# EAGLE design LogicLevelConverter (EAGLE 5.11)
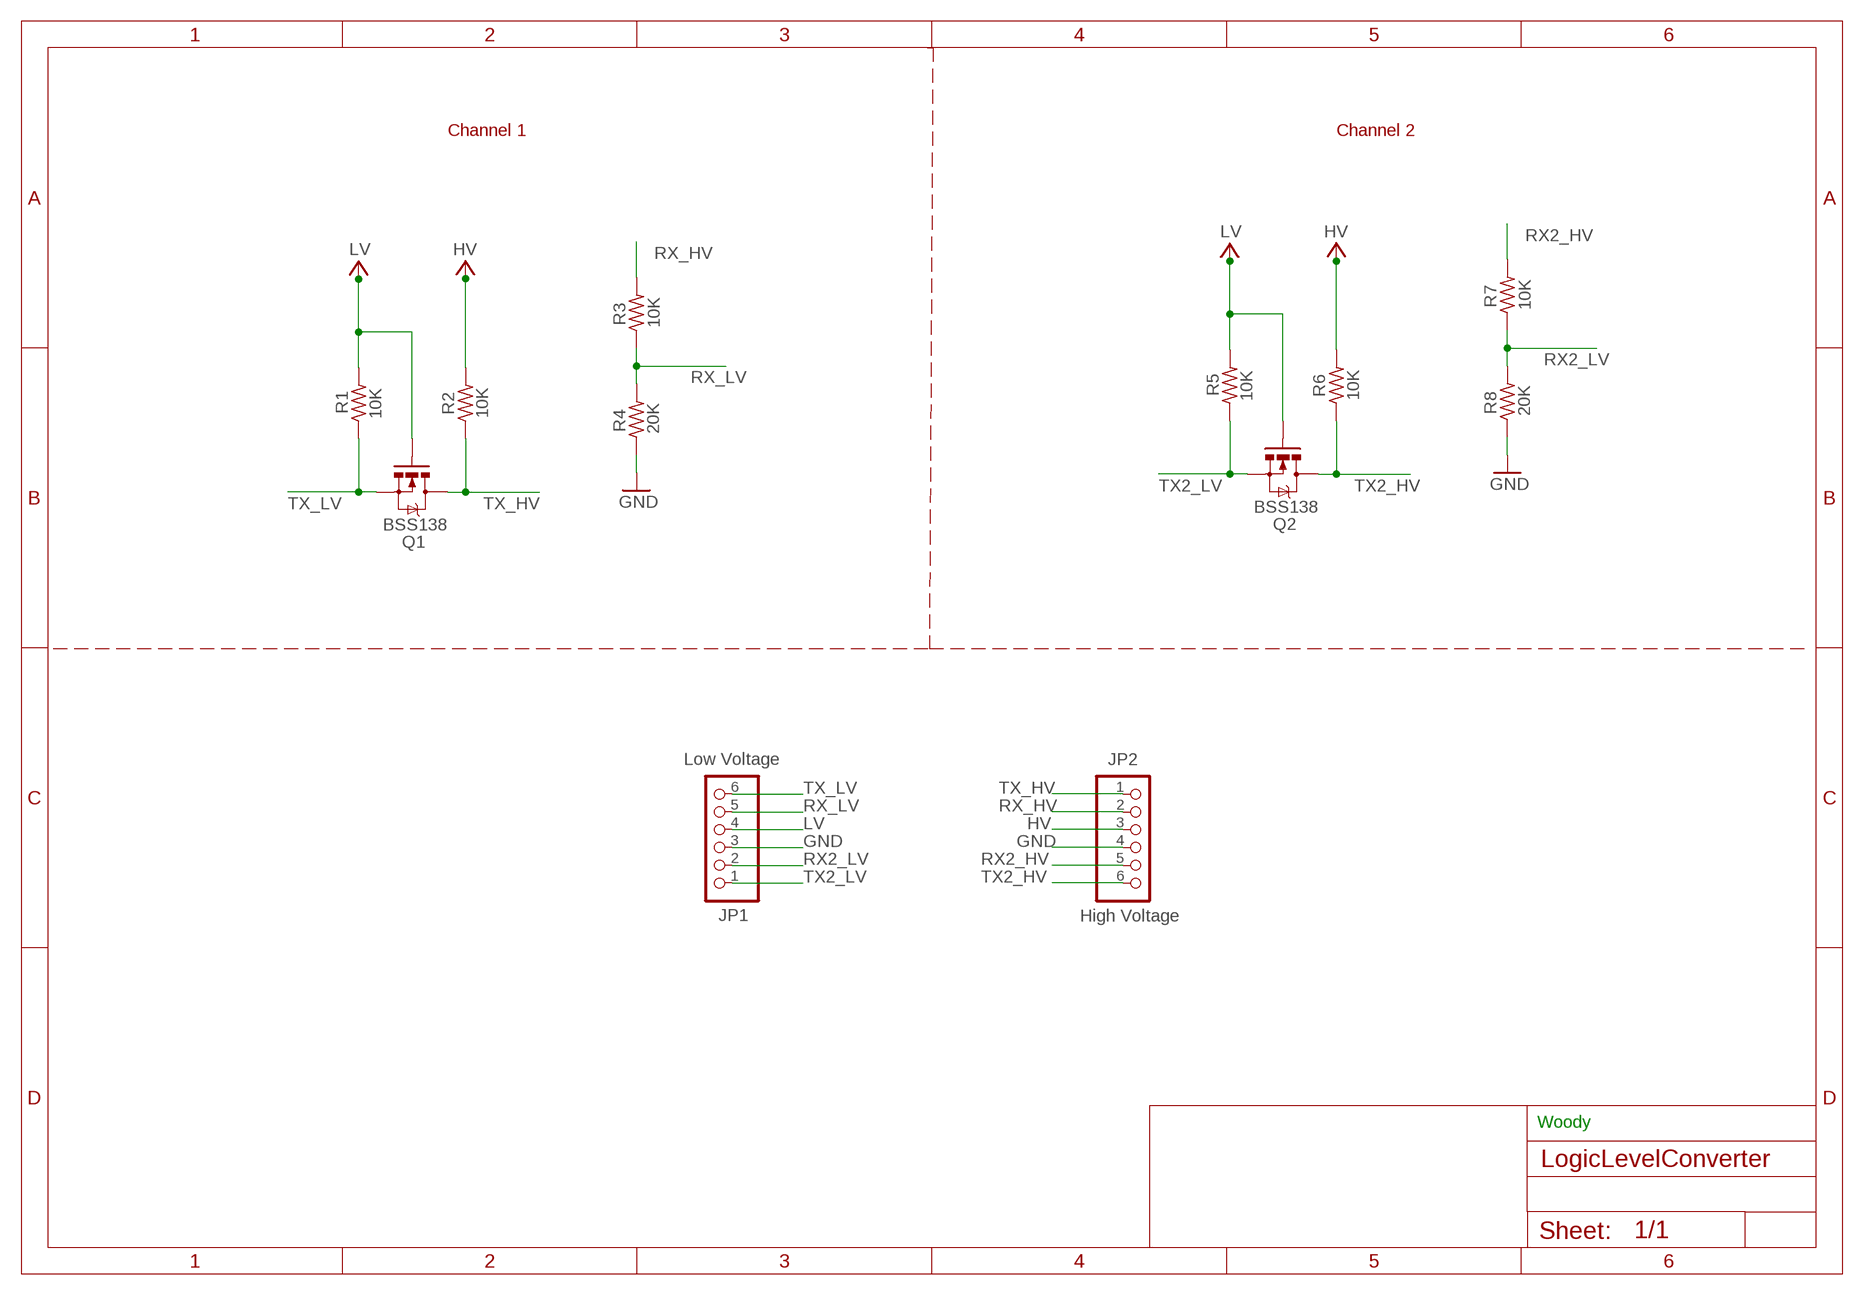
[diagram p0: schematic, sheet 1]

## Parts
JP1  Low Voltage  PINHD-1X06_2.54-S  [1X06-S]
JP2  High Voltage  PINHD-1X06_2.54-S  [1X06-S]
Q1  BSS138  MOSFET-NCHANNELSMD  [SOT23-3]
Q2  BSS138  MOSFET-NCHANNELSMD  [SOT23-3]
R1  10K  R-US_R0805  [R0805]
R2  10K  R-US_R0805  [R0805]
R3  10K  R-US_R0805  [R0805]
R4  20K  R-US_R0805  [R0805]
R5  10K  R-US_R0805  [R0805]
R6  10K  R-US_R0805  [R0805]
R7  10K  R-US_R0805  [R0805]
R8  20K  R-US_R0805  [R0805]

## Nets
GND: JP1.3 JP2.4 R4.1 R8.1
HV: JP2.3 R2.2 R6.2
LV: JP1.4 Q1.1(G) Q2.1(G) R1.2 R5.2
RX2_HV: JP2.5 R7.2
RX2_LV: JP1.2 R7.1 R8.2
RX_HV: JP2.2 R3.2
RX_LV: JP1.5 R3.1 R4.2
TX2_HV: JP2.6 Q2.3(D) R6.1
TX2_LV: JP1.1 Q2.2(S) R5.1
TX_HV: JP2.1 Q1.3(D) R2.1
TX_LV: JP1.6 Q1.2(S) R1.1

## Notes on the sheet
- Channel 1 | Channel 2
- Woody

## Library data of the parts
JP1 JP2 = pinhead-2:PINHD-1X06: PIN HEADER
Q1 Q2 = SparkFun:MOSFET-NCHANNEL
R1-R8 = resistor:R-US_: RESISTOR, American symbol

## Board
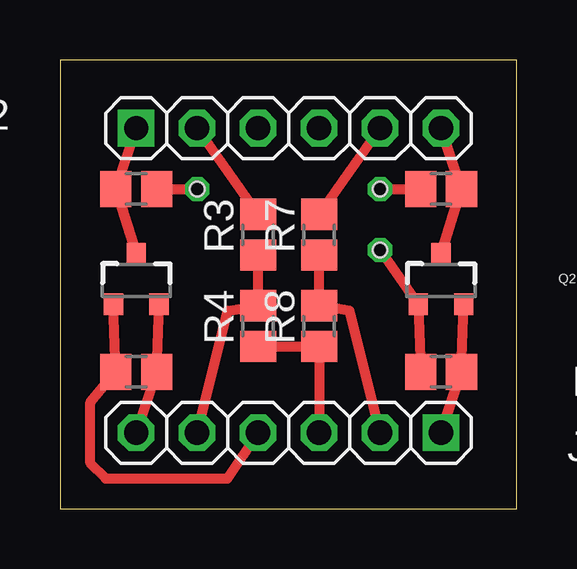
[diagram p1: board, top side]
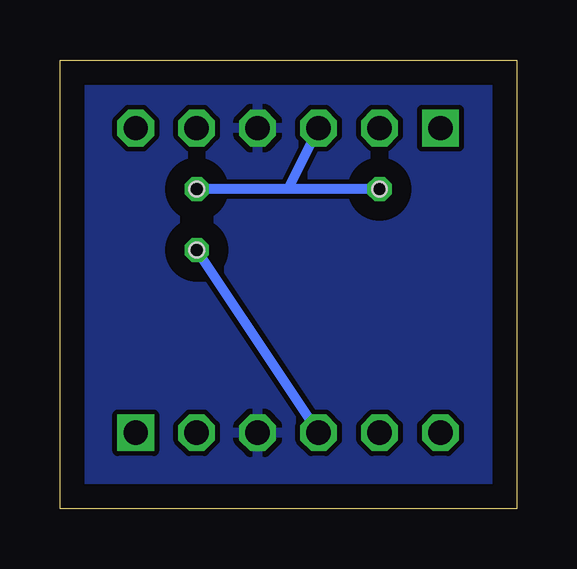
[diagram p2: board, bottom side, seen from below]

Size 19.03 x 18.72 mm. Coordinates in mm from the lower left corner, seen from the top.
Outline: 0,0 19.03,0 19.03,18.72 0,18.72 0,0
Copper layers (1*16): Top 0.035mm / dielectric 1.5mm / Bottom 0.035mm
Design rules "default": minimum track width 10mil, minimum drill 24mil, track to track 8mil, track to pad 8mil, pad to pad 8mil, via to via 8mil, smd to smd 8mil, copper to edge 40mil, drill to drill 8mil, minimum pad ring 10mil, minimum via ring 8mil, stop-mask expansion 4mil, vias tented up to drill 0mil, thermal gap 10mil
Holes 0.6 mm at 5.71,13.34 13.34,13.34 13.34,10.79

### Footprints (pad centres in the part's own frame; a part is rotated, then mirrored left to right if it is on the bottom)
1X06-S = drill 1.016 square: 1 -6.35,0 | drill 1.016 octagon: 2 -3.81,0; 3 -1.27,0; 4 1.27,0; 5 3.81,0; 6 6.35,0
SOT23-3 = smd 0.8 x 0.9: 1 -0.95,-1; 2 0.95,-1; 3 0,1.1
R0805 = smd 1.3 x 1.5: 1 -0.85,0; 2 0.85,0

### Placement (x,y rotation side)
JP1  9.53,3.17 180 top
JP2  9.53,15.88 0 top
Q1  3.17,9.53 0 top
Q2  15.88,9.53 0 top
R1  3.17,5.71 180 top
R2  3.17,13.34 0 top
R3  8.26,11.43 90 top
R4  8.26,7.62 90 top
R5  15.88,5.71 180 top
R6  15.88,13.34 180 top
R7  10.79,11.43 90 top
R8  10.79,7.62 90 top

### Tracks (layer width: path | path; a pad name or v marks a point on that pad's centre or on a via)
GND
  Top 0.406: JP1.3 R8.1 R4.1
  pour Bottom: 0.64,0.64 18.41,0.64 18.41,17.78 0.64,17.78
HV  (via drill 0.6)
  Top 0.406: R2.2 v5.71,13.34 | v13.34,13.34 R6.2
  Bottom 0.406: v5.71,13.34 9.53,13.34 | 9.53,13.34 v13.34,13.34 | 9.53,13.34 JP2.3
LV  (via drill 0.6)
  Top 0.406: Q1.1 R1.2 1.27,4.45 1.27,1.91 1.91,1.27 6.99,1.27 JP1.4 | R5.2 Q2.1 v13.34,10.79
  Bottom 0.406: JP1.4 v13.34,10.79
RX2_HV
  Top 0.406: R7.2 JP2.5
RX2_LV
  Top 0.406: R7.1 R8.2 12.06,8.26 JP1.2
RX_HV
  Top 0.406: R3.2 JP2.2
RX_LV
  Top 0.406: R3.1 R4.2 6.99,8.26 JP1.5
TX2_HV
  Top 0.406: JP2.6 R6.1 Q2.3
TX2_LV
  Top 0.406: Q2.2 R5.1 JP1.1
TX_HV
  Top 0.406: JP2.1 R2.1 Q1.3
TX_LV
  Top 0.406: Q1.2 R1.1 JP1.6